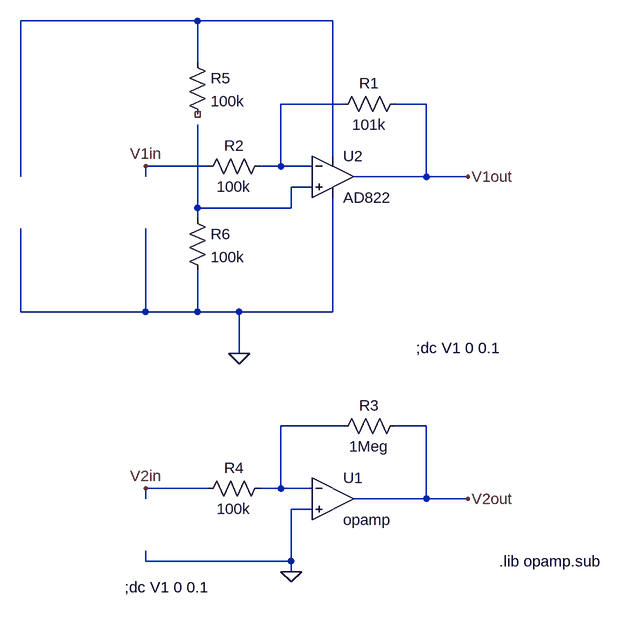
[diagram p0: schematic Test_Inverting_Amplifier.asc]
Test_Inverting_Amplifier.asc, the LTspice schematic file:
Version 4
SHEET 1 880 1380
WIRE 0 -96 -272 -96
WIRE 208 -96 0 -96
WIRE 0 -32 0 -96
WIRE 224 32 128 32
WIRE 352 32 304 32
WIRE 208 112 208 -96
WIRE 16 128 -80 128
WIRE 128 128 128 32
WIRE 128 128 96 128
WIRE 176 128 128 128
WIRE -272 144 -272 -96
WIRE -80 144 -80 128
WIRE 352 144 352 32
WIRE 352 144 240 144
WIRE 416 144 352 144
WIRE 176 160 144 160
WIRE 0 192 0 64
WIRE 144 192 144 160
WIRE 144 192 0 192
WIRE 0 208 0 192
WIRE -272 352 -272 224
WIRE -80 352 -80 224
WIRE -80 352 -272 352
WIRE 0 352 0 288
WIRE 0 352 -80 352
WIRE 64 352 0 352
WIRE 208 352 208 176
WIRE 208 352 64 352
WIRE 64 416 64 352
WIRE 224 528 128 528
WIRE 352 528 304 528
WIRE 16 624 -80 624
WIRE 128 624 128 528
WIRE 128 624 96 624
WIRE 176 624 128 624
WIRE -80 640 -80 624
WIRE 352 640 352 528
WIRE 352 640 240 640
WIRE 416 640 352 640
WIRE 176 656 144 656
WIRE -80 736 -80 720
WIRE 144 736 144 656
WIRE 144 736 -80 736
WIRE 144 752 144 736
FLAG -80 128 V1in
FLAG 416 144 V1out
FLAG 144 752 0
FLAG -80 624 V2in
FLAG 416 640 V2out
FLAG 64 416 0
SYMBOL res 320 16 R90
WINDOW 0 0 56 VBottom 2
WINDOW 3 32 56 VTop 2
SYMATTR InstName R1
SYMATTR Value 101k
SYMBOL res 112 112 R90
WINDOW 0 0 56 VBottom 2
WINDOW 3 32 56 VTop 2
SYMATTR InstName R2
SYMATTR Value 100k
SYMBOL AD822 208 80 R0
SYMATTR InstName U2
SYMBOL res 320 512 R90
WINDOW 0 0 56 VBottom 2
WINDOW 3 32 56 VTop 2
SYMATTR InstName R3
SYMATTR Value 1Meg
SYMBOL res 112 608 R90
WINDOW 0 0 56 VBottom 2
WINDOW 3 32 56 VTop 2
SYMATTR InstName R4
SYMATTR Value 100k
SYMBOL OpAmps\\opamp 208 576 R0
SYMATTR InstName U1
SYMBOL res -16 -48 R0
SYMATTR InstName R5
SYMATTR Value 100k
SYMBOL res -16 192 R0
SYMATTR InstName R6
SYMATTR Value 100k
TEXT 336 408 Left 2 !;dc V1 0 0.1
TEXT 464 736 Left 2 !.lib opamp.sub
TEXT -112 776 Left 2 !;dc V1 0 0.1

The netlist it stands for:
* Test_Inverting_Amplifier.asc
R1 V1out N002 101k
R2 N002 V1in 100k
* U2: AD822 (symbol AD822 not available, pins judged from their places): In+=N003 In-=N002 V+=N001 V-=0 OUT=V1out
R3 V2out N004 1Meg
R4 N004 V2in 100k
XU1 N004 0 V2out opamp Aol=100K GBW=10Meg  ; pins invin noninvin out
R5 N001 NC_01 100k
R6 N003 0 100k
;dc V1 0 0.1
.lib opamp.sub
;dc V1 0 0.1
.backanno
.end